# Altium schematic sheet DSI_FLAT.SchDoc: DSI FLAT
size A4; Author: Silvio Navaretti; CompanyName: Arduino SRL; DrawnBy: Silvio Navaretti; Engineer: Silvio Navaretti; Organization: Arduino SRL; DocumentNumber: ASX00083; SheetNumber: 7; SheetTotal: 11; RevAuthor: Silvio Navaretti
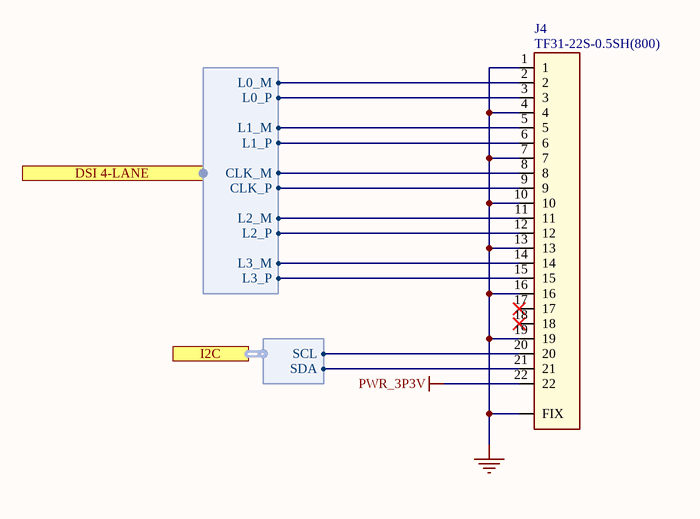
[diagram p0: DSI_FLAT.SchDoc]

## Parts
J4  TF31-22S-0.5SH(800)  [TF31-22S-0.5SH(800)]

## Ports
DSI 4-LANE (harness IMOLA_DSI), I2C (harness I2C)

## Harnesses
I2C: SDA, SCL
IMOLA_DSI: L1_P, L1_M, L3_P, L3_M, CLK_P, CLK_M, L0_P, L0_M, L2_P, L2_M

## Nets
GND: J4.1 J4.4 J4.7 J4.10 J4.13 J4.16 J4.19 J4.FIX
PWR_3P3V: J4.22
NetJ4_2: J4.2 ; port DSI 4-LANE.L0_M
NetJ4_3: J4.3 ; port DSI 4-LANE.L0_P
NetJ4_5: J4.5 ; port DSI 4-LANE.L1_M
NetJ4_6: J4.6 ; port DSI 4-LANE.L1_P
NetJ4_8: J4.8 ; port DSI 4-LANE.CLK_M
NetJ4_9: J4.9 ; port DSI 4-LANE.CLK_P
NetJ4_11: J4.11 ; port DSI 4-LANE.L2_M
NetJ4_12: J4.12 ; port DSI 4-LANE.L2_P
NetJ4_14: J4.14 ; port DSI 4-LANE.L3_M
NetJ4_15: J4.15 ; port DSI 4-LANE.L3_P
NetJ4_20: J4.20 ; port I2C.SCL
NetJ4_21: J4.21 ; port I2C.SDA

Not connected (* = marked no-connect by the designer): J4 17* 18*

## Notes on the sheet
- Title:
- ID:
- Date:
- Time:
- Version:
- Sheet
- of
- RevAuthor:
- Reference Designs ARE PROVIDED "AS IS" AND "WITH ALL FAULTS. Arduino SA DISCLAIMS ALL OTHER WARRANTIES, EXPRESS OR IMPLIED, REGARDING PRODUCTS, INCLUDING BUT NOT LIMITED TO, ANY IMPLIED WARRANTIES OF MERCHANTABILITY OR FITNESS FOR A PARTICULAR PURPOSE.
  Arduino SA may make changes to specifications and product descriptions at any time, without notice. The Customer must not rely on the absence or characteristics of any features or instructions marked "reserved" or "undefined". Arduino SA reserves these for future definition and shall have no responsibility whatsoever for conflicts or incompatibilities arising from future changes to them. The product information on the Web Site or Materials is subject to change without notice.
  Do not finalize a design with this info. ARDUINO and other Arduino brands and logos and Trademarks of Arduino SA. All Arduino SA Trademarks cannot be used without owner's formal permission.
- File:
- Author:

## Library data of the parts
J4 = J0553-A.2: CONN FFC/FPC Connector, 22 Contact(s), 1 Row(s), BOTTOM CONTACT, Female, Right Angle, 0.5mm Pitch; Manufacturer: Hirose; Code Arduino: J0553; Part Number: TF31-22S-0.5SH(800)